# Altium project PCB_Tel_GPRS_BT-V1_Rev1.PrjPcb (part 2 of 2)
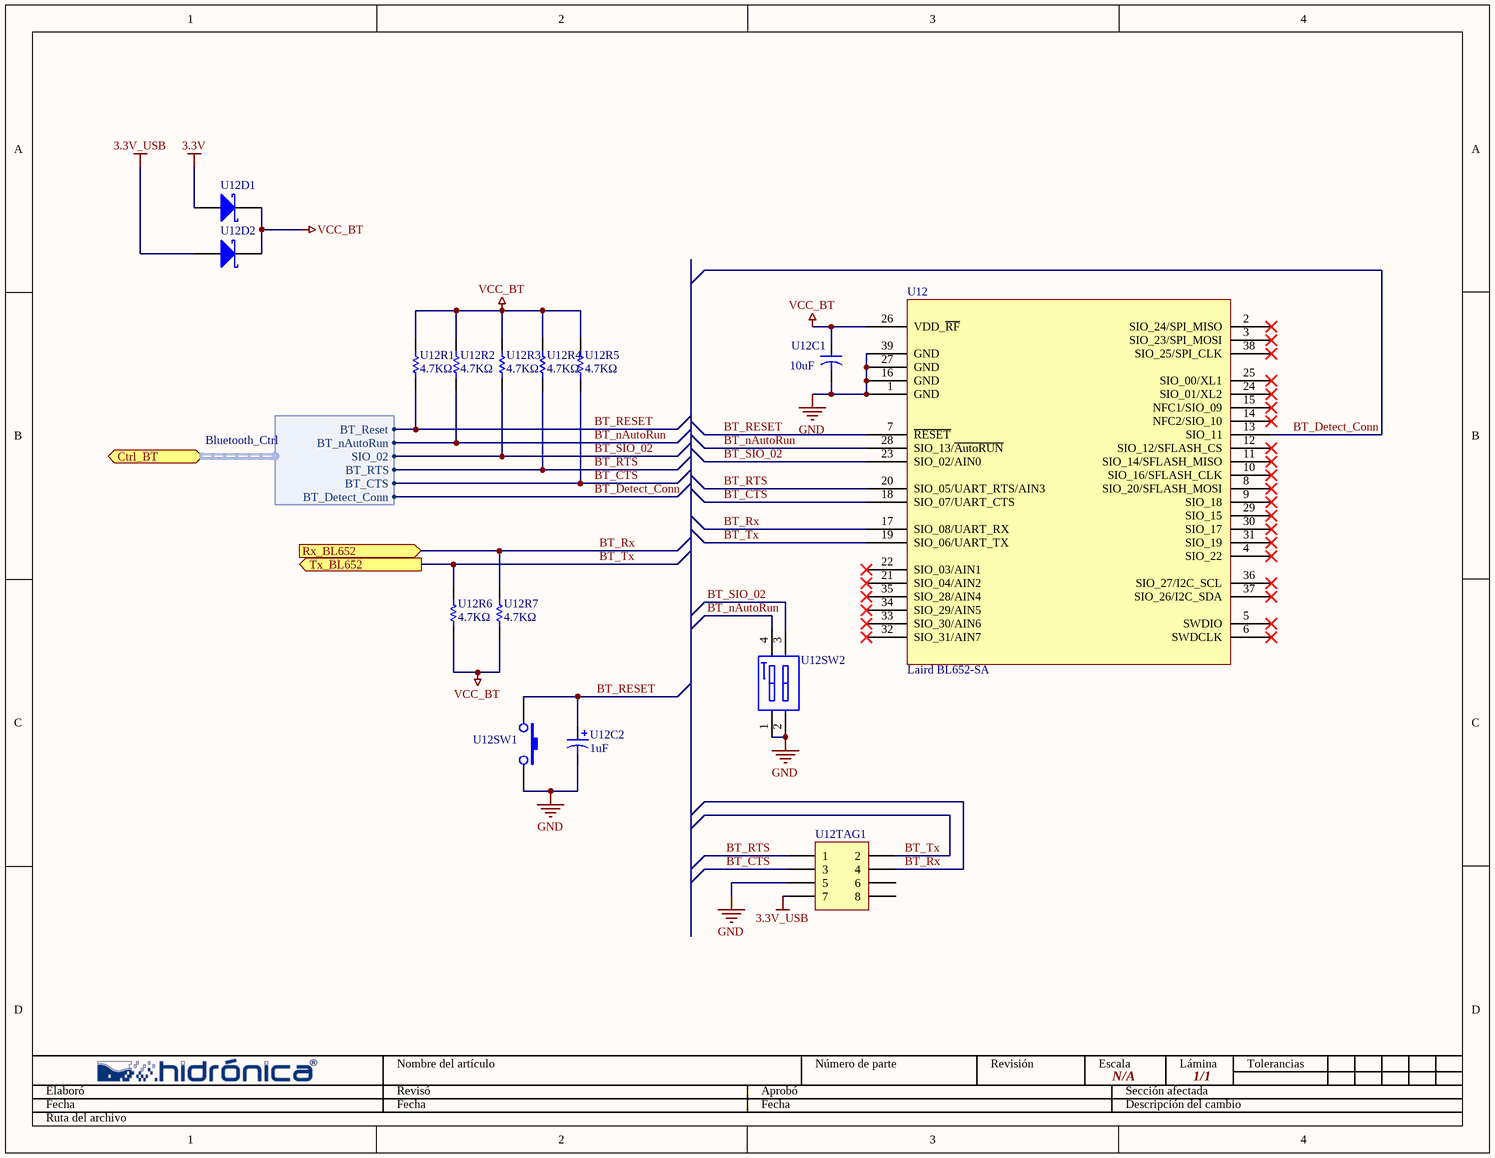
[diagram p13: Modulo BL652.SchDoc]

## Nets that join several sheets
3.3V: Fuente3V (5 pins), Interfaz de Memoria (6 pins), Interfaz_RTC (7 pins), MSP430 (7 pins), Interfaz_RS232 (U10.19 U10C1.2), UART_Multiplexor (U11.8 U11C1.2), SDCard (8 pins), Modulo BL652 (U12D1.1)
3.3VP: Fuente3V (U3.2 U3C2.1), Modem-GPRS (7 pins)
7.2V-12V: Principal (PWR_RS-232_CONN.2), Fuente3V (U2.6 U4.4 U4.5 U4C1.2), Monitoreo-Bateria (U5R1.2), Fuente-12V (U1D2.2)
24-32V: Principal (PWR_RS-232_CONN.1), Monitoreo-Bateria (U5R3.2), Fuente-12V (5 pins)
GND: Principal (PWR_RS-232_CONN.3 PWR_RS-232_CONN.8 PWR_RS-232_CONN.10), Fuente3V (10 pins), Interfaz de Memoria (U7.4 U7.7 U7C1.1), Interfaz_RTC (U8.6 U8C1.2 U8C2.2), Monitoreo-Bateria (U5C1.2 U5D1.1 U5R2.1), MSP430 (10 pins), Fuente-12V (12 pins), Modem-GPRS (14 pins), SIM (8 pins), Interfaz_RS232 (U10.18 U10C1.1 U10C4.1 U10C5.1), UART_Multiplexor (U11.3 U11C1.1), SDCard (U9.6 U9C1.2), Modulo BL652 (10 pins)
BT_CTS: MSP430 (U6.23), Modulo BL652 (U12.18 U12R5.2 U12TAG1.3)
BT_Detect_Conn: MSP430 (U6.12 U6C5.1 U6R2.1), Modulo BL652 (U12.13)
BT_nAutoRun: MSP430 (U6.26), Modulo BL652 (U12.28 U12R2.2 U12SW2.4)
BT_RESET: MSP430 (U6.25), Modulo BL652 (U12.7 U12C2.1 U12R1.2 U12SW1.1)
BT_RTS: MSP430 (U6.24), Modulo BL652 (U12.20 U12R4.2 U12TAG1.1)
BT_Rx: UART_Multiplexor (U11.9), Modulo BL652 (U12.17 U12R7.1 U12TAG1.4)
BT_SIO_02: MSP430 (U6.27), Modulo BL652 (U12.23 U12R3.2 U12SW2.3)
BT_Tx: UART_Multiplexor (U11.7), Modulo BL652 (U12.19 U12R6.1 U12TAG1.2)
Int-Puerta: Principal (PWR_RS-232_CONN.9), MSP430 (U6.6 U6R3.1)
NetU2_1: Fuente3V (U2.1), MSP430 (U6.18)
NetU5D1_2: Monitoreo-Bateria (U5D1.2 U5R4.1), MSP430 (U6.59)
NetU6_3: MSP430 (U6.3), Interfaz_RS232 (U10.1)
NetU6_4: MSP430 (U6.4), Interfaz_RS232 (U10.14 U10.20)
NetU6_5: MSP430 (U6.5), Modem-GPRS (U13.42 U13D1.2 U13R3.1)
NetU6_13: MSP430 (U6.13), Modem-GPRS (U13.23)
NetU6_15: MSP430 (U6.15), Modem-GPRS (U13.20 U13R1.1)
NetU6_16: MSP430 (U6.16), Modem-GPRS (U13.31)
NetU6_17: MSP430 (U6.17), Modem-GPRS (U13.17)
NetU6_19: MSP430 (U6.19), Modem-GPRS (U13.22)
NetU6_30: MSP430 (U6.30), UART_Multiplexor (U11.1 U11.5)
NetU6_32: MSP430 (U6.32), Interfaz_RS232 (U10B_A1.1 U10B_B2.2), UART_Multiplexor (U11.10)
NetU6_33: MSP430 (U6.33), Interfaz_RS232 (U10B_A2.1 U10B_B1.2), UART_Multiplexor (U11.6)
NetU6_34: MSP430 (U6.34), Interfaz_RS232 (U10.12)
NetU6_35: MSP430 (U6.35), Interfaz_RS232 (U10.10)
NetU6_36: Interfaz_RTC (U8.2), MSP430 (U6.36)
NetU6_37: Interfaz_RTC (U8.7 U8R3.2), MSP430 (U6.37)
NetU6_38: Interfaz_RTC (U8.5 U8R2.1), MSP430 (U6.38)
NetU6_39: Interfaz_RTC (U8.4 U8R1.1), MSP430 (U6.39)
NetU6_40: Interfaz de Memoria (U7.5 U7R2.1), MSP430 (U6.40)
NetU6_41: Interfaz de Memoria (U7.6 U7R1.1), MSP430 (U6.41)
NetU6_44: MSP430 (U6.44), SDCard (U9.2 U9R2.1)
NetU6_45: MSP430 (U6.45), SDCard (U9.3 U9R3.1)
NetU6_46: MSP430 (U6.46), SDCard (U9.7 U9R5.1)
NetU6_47: MSP430 (U6.47), SDCard (U9.5 U9R4.1)
NetU11_2: Modem-GPRS (U13.11), UART_Multiplexor (U11.2)
NetU11_4: Modem-GPRS (U13.13), UART_Multiplexor (U11.4)
NetU13_8: Modem-GPRS (U13.8), SIM (6 pins)
NetU13_10: Modem-GPRS (U13.10), SIM (U14R4.1)
NetU13_12: Modem-GPRS (U13.12), SIM (U14R3.1)
NetU13_14: Modem-GPRS (U13.14), SIM (U14R2.1)
Rx1_RS232: Principal (PWR_RS-232_CONN.6), Interfaz_RS232 (U10L4.2)
Rx2_RS232: Principal (PWR_RS-232_CONN.4), Interfaz_RS232 (U10L2.2)
Tx1_RS232: Principal (PWR_RS-232_CONN.7), Interfaz_RS232 (U10L3.2)
Tx2_RS232: Principal (PWR_RS-232_CONN.5), Interfaz_RS232 (U10L1.2)
UART-DCD: MSP430 (U6.21), Modem-GPRS (U13.33)
UART-RTS: MSP430 (U6.20), Modem-GPRS (U13.25)
WAKE#: MSP430 (U6.22), Modem-GPRS (U13.1)